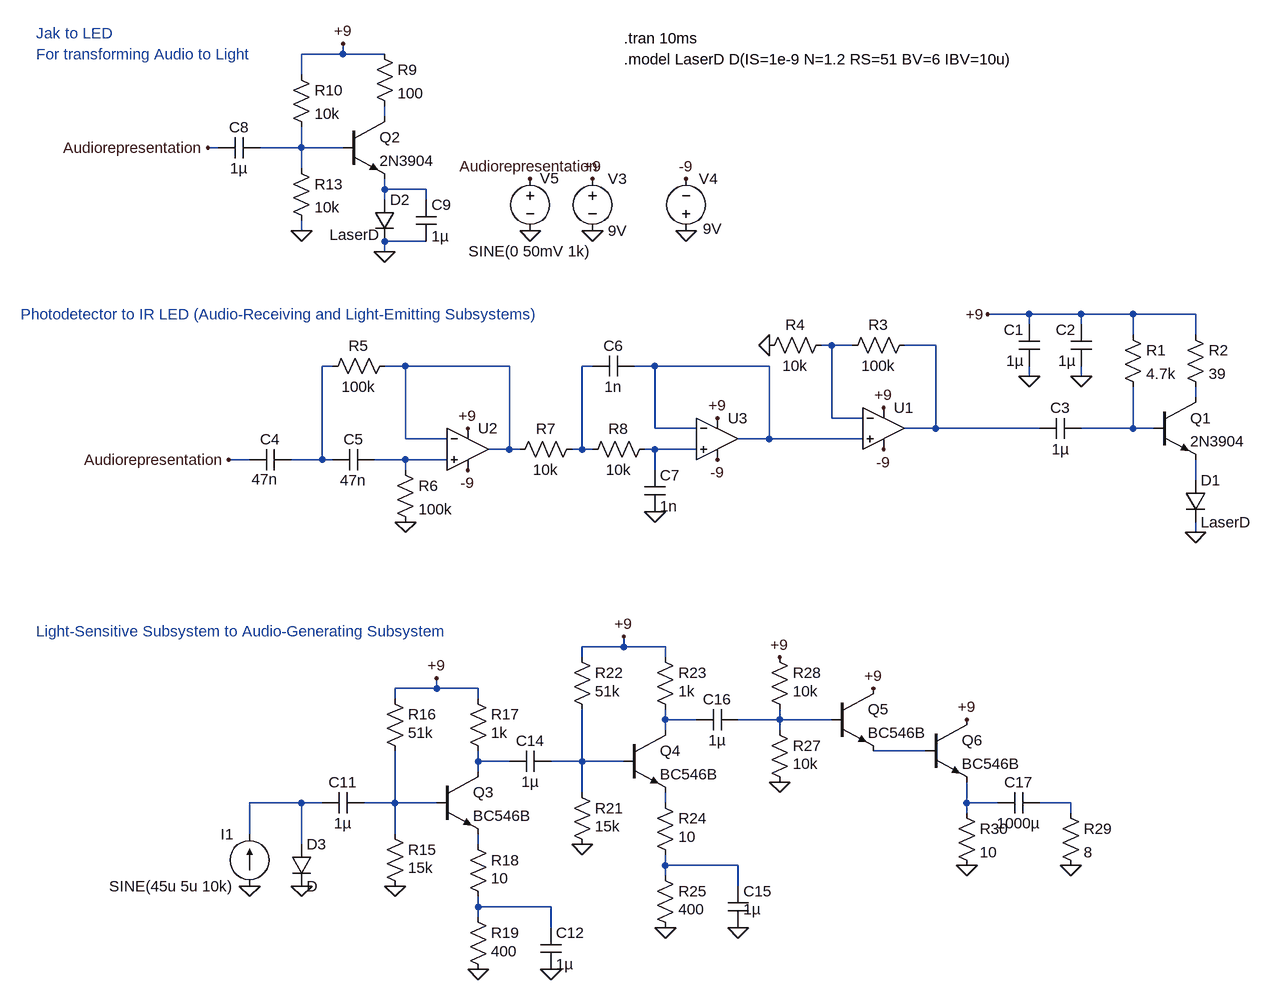
[diagram p0: schematic proje_deneme_mus.asc]
proje_deneme_mus.asc, the LTspice schematic file:
Version 4
SHEET 1 2692 1444
WIRE -800 -208 -800 -224
WIRE -800 -208 -864 -208
WIRE -736 -208 -800 -208
WIRE -864 -176 -864 -208
WIRE -736 -112 -736 -128
WIRE -992 -64 -1008 -64
WIRE -864 -64 -864 -96
WIRE -864 -64 -928 -64
WIRE -800 -64 -864 -64
WIRE -864 -32 -864 -64
WIRE -736 0 -736 -16
WIRE -672 0 -736 0
WIRE -736 16 -736 0
WIRE -672 16 -672 0
WIRE -864 64 -864 48
WIRE -672 80 -736 80
WIRE -736 96 -736 80
WIRE 256 192 192 192
WIRE 336 192 256 192
WIRE 416 192 336 192
WIRE 512 192 416 192
WIRE 256 208 256 192
WIRE 336 208 336 192
WIRE 416 224 416 192
WIRE 512 224 512 192
WIRE -48 240 -64 240
WIRE -16 240 -48 240
WIRE 112 240 64 240
WIRE -816 272 -832 272
WIRE -704 272 -736 272
WIRE -544 272 -704 272
WIRE -416 272 -432 272
WIRE -320 272 -352 272
WIRE -144 272 -320 272
WIRE 256 288 256 272
WIRE 336 288 336 272
WIRE 512 320 512 304
WIRE -48 352 -48 240
WIRE 0 352 -48 352
WIRE -320 368 -320 272
WIRE -256 368 -320 368
WIRE 112 368 112 240
WIRE 112 368 64 368
WIRE 272 368 112 368
WIRE 416 368 416 304
WIRE 416 368 336 368
WIRE 448 368 416 368
WIRE -704 384 -704 272
WIRE -640 384 -704 384
WIRE -144 384 -144 272
WIRE -144 384 -192 384
WIRE 0 384 -144 384
WIRE -544 400 -544 272
WIRE -544 400 -576 400
WIRE -528 400 -544 400
WIRE -432 400 -432 272
WIRE -432 400 -448 400
WIRE -416 400 -432 400
WIRE -320 400 -336 400
WIRE -256 400 -320 400
WIRE -944 416 -976 416
WIRE -832 416 -832 272
WIRE -832 416 -880 416
WIRE -816 416 -832 416
WIRE -704 416 -752 416
WIRE -640 416 -704 416
WIRE -704 432 -704 416
WIRE -320 432 -320 400
WIRE 512 448 512 416
WIRE 512 528 512 512
WIRE -368 704 -368 688
WIRE -368 704 -432 704
WIRE -304 704 -368 704
WIRE -432 720 -432 704
WIRE -304 720 -304 704
WIRE -656 768 -656 752
WIRE -656 768 -720 768
WIRE -592 768 -656 768
WIRE -720 784 -720 768
WIRE -592 784 -592 768
WIRE -304 816 -304 800
WIRE -256 816 -304 816
WIRE -128 816 -128 800
WIRE -128 816 -192 816
WIRE -48 816 -128 816
WIRE -304 832 -304 816
WIRE -128 832 -128 816
WIRE 96 864 16 864
WIRE -592 880 -592 864
WIRE -544 880 -592 880
WIRE -432 880 -432 800
WIRE -432 880 -480 880
WIRE -368 880 -432 880
WIRE -592 896 -592 880
WIRE -432 928 -432 880
WIRE -864 944 -944 944
WIRE -832 944 -864 944
WIRE -720 944 -720 864
WIRE -720 944 -768 944
WIRE -656 944 -720 944
WIRE -304 944 -304 928
WIRE 160 944 160 912
WIRE 208 944 160 944
WIRE 320 944 272 944
WIRE 160 960 160 944
WIRE 320 960 320 944
WIRE -944 992 -944 944
WIRE -720 992 -720 944
WIRE -864 1008 -864 944
WIRE -592 1008 -592 992
WIRE -304 1040 -304 1024
WIRE -192 1040 -304 1040
WIRE -304 1056 -304 1040
WIRE -192 1072 -192 1040
WIRE -592 1104 -592 1088
WIRE -480 1104 -592 1104
WIRE -592 1120 -592 1104
WIRE -480 1136 -480 1104
FLAG 336 288 0
FLAG 256 288 0
FLAG 512 528 0
FLAG 32 336 +9
FLAG 32 400 -9
FLAG -144 240 0
FLAG -272 64 0
FLAG -416 64 0
FLAG -416 -16 +9
FLAG -272 -16 -9
FLAG -704 512 0
FLAG -608 368 +9
FLAG -224 352 +9
FLAG -224 416 -9
FLAG -608 432 -9
FLAG -320 496 0
FLAG -512 64 0
FLAG 192 192 +9
FLAG -800 -224 +9
FLAG -736 96 0
FLAG -864 64 0
FLAG -720 1072 0
FLAG -656 752 +9
FLAG -432 1008 0
FLAG -368 688 +9
FLAG -304 1136 0
FLAG -192 1136 0
FLAG -128 912 0
FLAG -128 720 +9
FLAG 16 768 +9
FLAG 160 816 +9
FLAG 160 1040 0
FLAG 320 1040 0
FLAG -592 1200 0
FLAG -480 1200 0
FLAG -944 1072 0
FLAG -864 1072 0
FLAG -976 416 Audiorepresentation
FLAG -512 -16 Audiorepresentation
FLAG -1008 -64 Audiorepresentation
SYMBOL cap 272 272 R180
WINDOW 0 24 56 Left 2
WINDOW 3 24 8 Left 2
SYMATTR InstName C1
SYMATTR Value 1µ
SYMBOL cap 352 272 R180
WINDOW 0 24 56 Left 2
WINDOW 3 24 8 Left 2
SYMATTR InstName C2
SYMATTR Value 1µ
SYMBOL cap 336 352 R90
WINDOW 0 0 32 VBottom 2
WINDOW 3 32 32 VTop 2
SYMATTR InstName C3
SYMATTR Value 1µ
SYMBOL res 400 208 R0
SYMATTR InstName R1
SYMATTR Value 4.7k
SYMBOL res 496 208 R0
SYMATTR InstName R2
SYMATTR Value 39
SYMBOL npn 448 320 R0
SYMATTR InstName Q1
SYMATTR Value 2N3904
SYMBOL diode 496 448 R0
SYMATTR InstName D1
SYMATTR Value LaserD
SYMBOL OpAmps\\UniversalOpAmp2 32 368 R0
SYMATTR InstName U1
SYMBOL res 80 224 R90
WINDOW 0 0 56 VBottom 2
WINDOW 3 32 56 VTop 2
SYMATTR InstName R3
SYMATTR Value 100k
SYMBOL res -160 256 R270
WINDOW 0 32 56 VTop 2
WINDOW 3 0 56 VBottom 2
SYMATTR InstName R4
SYMATTR Value 10k
SYMBOL voltage -416 -32 R0
WINDOW 123 0 0 Left 0
WINDOW 39 0 0 Left 0
SYMATTR InstName V3
SYMATTR Value 9V
SYMBOL voltage -272 80 R180
WINDOW 0 -49 96 Left 2
WINDOW 3 -55 19 Left 2
WINDOW 123 0 0 Left 0
WINDOW 39 0 0 Left 0
SYMATTR InstName V4
SYMATTR Value 9V
SYMBOL cap -880 432 M270
WINDOW 0 32 32 VTop 2
WINDOW 3 -14 61 VLeft 2
SYMATTR InstName C4
SYMATTR Value 47n
SYMBOL cap -752 400 R90
WINDOW 0 0 32 VBottom 2
WINDOW 3 32 32 VTop 2
SYMATTR InstName C5
SYMATTR Value 47n
SYMBOL res -720 256 R90
WINDOW 0 0 56 VBottom 2
WINDOW 3 32 56 VTop 2
SYMATTR InstName R5
SYMATTR Value 100k
SYMBOL res -720 416 R0
SYMATTR InstName R6
SYMATTR Value 100k
SYMBOL OpAmps\\UniversalOpAmp2 -608 400 R0
SYMATTR InstName U2
SYMBOL OpAmps\\UniversalOpAmp2 -224 384 R0
SYMATTR InstName U3
SYMBOL res -432 384 R90
WINDOW 0 0 56 VBottom 2
WINDOW 3 32 56 VTop 2
SYMATTR InstName R7
SYMATTR Value 10k
SYMBOL cap -352 256 R90
WINDOW 0 0 32 VBottom 2
WINDOW 3 32 32 VTop 2
SYMATTR InstName C6
SYMATTR Value 1n
SYMBOL cap -336 432 R0
SYMATTR InstName C7
SYMATTR Value 1n
SYMBOL res -320 384 R90
WINDOW 0 0 56 VBottom 2
WINDOW 3 32 56 VTop 2
SYMATTR InstName R8
SYMATTR Value 10k
SYMBOL voltage -512 -32 R0
WINDOW 0 30 31 Bottom 2
WINDOW 3 -1 112 Top 2
WINDOW 123 0 0 Left 0
WINDOW 39 0 0 Left 0
SYMATTR InstName V5
SYMATTR Value SINE(0 50mV 1k)
SYMBOL cap -928 -80 R90
WINDOW 0 0 32 VBottom 2
WINDOW 3 32 32 VTop 2
SYMATTR InstName C8
SYMATTR Value 1µ
SYMBOL npn -800 -112 R0
SYMATTR InstName Q2
SYMATTR Value 2N3904
SYMBOL res -752 -224 R0
SYMATTR InstName R9
SYMATTR Value 100
SYMBOL res -880 -192 R0
SYMATTR InstName R10
SYMATTR Value 10k
SYMBOL res -880 -48 R0
SYMATTR InstName R13
SYMATTR Value 10k
SYMBOL diode -752 16 R0
WINDOW 3 -69 54 Left 2
SYMATTR InstName D2
SYMATTR Value LaserD
SYMBOL cap -688 16 R0
SYMATTR InstName C9
SYMATTR Value 1µ
SYMBOL cap -768 928 R90
WINDOW 0 0 32 VBottom 2
WINDOW 3 32 32 VTop 2
SYMATTR InstName C11
SYMATTR Value 1µ
SYMBOL res -736 976 R0
WINDOW 3 36 68 Left 2
SYMATTR InstName R15
SYMATTR Value 15k
SYMBOL res -736 768 R0
WINDOW 3 36 68 Left 2
SYMATTR InstName R16
SYMATTR Value 51k
SYMBOL res -608 768 R0
WINDOW 3 36 68 Left 2
SYMATTR InstName R17
SYMATTR Value 1k
SYMBOL npn -656 896 R0
SYMATTR InstName Q3
SYMATTR Value BC546B
SYMBOL cap -480 864 R90
WINDOW 0 0 32 VBottom 2
WINDOW 3 32 32 VTop 2
SYMATTR InstName C14
SYMATTR Value 1µ
SYMBOL res -448 912 R0
WINDOW 3 36 68 Left 2
SYMATTR InstName R21
SYMATTR Value 15k
SYMBOL res -448 704 R0
WINDOW 3 36 68 Left 2
SYMATTR InstName R22
SYMATTR Value 51k
SYMBOL res -320 704 R0
WINDOW 3 36 68 Left 2
SYMATTR InstName R23
SYMATTR Value 1k
SYMBOL npn -368 832 R0
SYMATTR InstName Q4
SYMATTR Value BC546B
SYMBOL res -320 928 R0
WINDOW 3 36 68 Left 2
SYMATTR InstName R24
SYMATTR Value 10
SYMBOL res -320 1040 R0
WINDOW 3 36 68 Left 2
SYMATTR InstName R25
SYMATTR Value 400
SYMBOL cap -208 1072 R0
WINDOW 3 24 36 Left 2
SYMATTR InstName C15
SYMATTR Value 1µ
SYMBOL cap -192 800 R90
WINDOW 0 0 32 VBottom 2
WINDOW 3 32 32 VTop 2
SYMATTR InstName C16
SYMATTR Value 1µ
SYMBOL res -144 816 R0
WINDOW 3 36 68 Left 2
SYMATTR InstName R27
SYMATTR Value 10k
SYMBOL res -144 704 R0
WINDOW 3 36 68 Left 2
SYMATTR InstName R28
SYMATTR Value 10k
SYMBOL npn -48 768 R0
SYMATTR InstName Q5
SYMATTR Value BC546B
SYMBOL npn 96 816 R0
SYMATTR InstName Q6
SYMATTR Value BC546B
SYMBOL cap 272 928 R90
WINDOW 0 0 32 VBottom 2
WINDOW 3 32 32 VTop 2
SYMATTR InstName C17
SYMATTR Value 1000µ
SYMBOL res 304 944 R0
SYMATTR InstName R29
SYMATTR Value 8
SYMBOL res 144 944 R0
SYMATTR InstName R30
SYMATTR Value 10
SYMBOL res -608 992 R0
WINDOW 3 36 68 Left 2
SYMATTR InstName R18
SYMATTR Value 10
SYMBOL res -608 1104 R0
WINDOW 3 36 68 Left 2
SYMATTR InstName R19
SYMATTR Value 400
SYMBOL cap -496 1136 R0
SYMATTR InstName C12
SYMATTR Value 1µ
SYMBOL current -944 1072 R180
WINDOW 0 24 80 Left 2
WINDOW 3 24 0 Left 2
WINDOW 123 0 0 Left 0
WINDOW 39 0 0 Left 0
SYMATTR InstName I1
SYMATTR Value SINE(45u 5u 10k)
SYMBOL diode -880 1008 R0
SYMATTR InstName D3
TEXT -368 -232 Left 2 !.tran 10ms
TEXT -368 -200 Left 2 !.model LaserD D(IS=1e-9 N=1.2 RS=51 BV=6 IBV=10u)
TEXT -1272 -240 Left 2 ;Jak to LED
TEXT -1296 192 Left 2 ;Photodetector to IR LED (Audio-Receiving and Light-Emitting Subsystems)
TEXT -1272 -208 Left 2 ;For transforming Audio to Light
TEXT -1272 680 Left 2 ;Light-Sensitive Subsystem to Audio-Generating Subsystem

The netlist it stands for:
* proje_deneme_mus.asc
C1 0 +9 1µ
C2 0 +9 1µ
C3 N011 N005 1µ
R1 +9 N011 4.7k
R2 +9 N010 39
Q1 N010 N011 N014 0 2N3904
D1 N014 0 LaserD
XU1 N009 N004 +9 -9 N005 level2 Avol=1Meg GBW=10Meg Slew=10Meg Ilimit=25m Rail=0 Vos=0 En=0 Enk=0 In=0 Ink=0 Rin=500Meg  ; pins In+ In- V+ V- OUT
R3 N005 N004 100k
R4 0 N004 10k
V3 +9 0 9V
V4 0 -9 9V
C4 N006 Audiorepresentation 47n
C5 N013 N006 47n
R5 N007 N006 100k
R6 N013 0 100k
XU2 N013 N007 +9 -9 N007 level2 Avol=1Meg GBW=10Meg Slew=10Meg Ilimit=25m Rail=0 Vos=0 En=0 Enk=0 In=0 Ink=0 Rin=500Meg  ; pins In+ In- V+ V- OUT
XU3 N012 N009 +9 -9 N009 level2 Avol=1Meg GBW=10Meg Slew=10Meg Ilimit=25m Rail=0 Vos=0 En=0 Enk=0 In=0 Ink=0 Rin=500Meg  ; pins In+ In- V+ V- OUT
R7 N008 N007 10k
C6 N009 N008 1n
C7 N012 0 1n
R8 N012 N008 10k
V5 Audiorepresentation 0 SINE(0 50mV 1k)
C8 N002 Audiorepresentation 1µ
Q2 N001 N002 N003 0 2N3904
R9 +9 N001 100
R10 +9 N002 10k
R13 N002 0 10k
D2 N003 0 LaserD
C9 N003 0 1µ
C11 N021 N020 1µ
R15 N021 0 15k
R16 +9 N021 51k
R17 +9 N018 1k
Q3 N018 N021 N025 0 BC546B
C14 N019 N018 1µ
R21 N019 0 15k
R22 +9 N019 51k
R23 +9 N015 1k
Q4 N015 N019 N022 0 BC546B
R24 N022 N026 10
R25 N026 0 400
C15 N026 0 1µ
C16 N016 N015 1µ
R27 N016 0 10k
R28 +9 N016 10k
Q5 +9 N016 N017 0 BC546B
Q6 +9 N017 N023 0 BC546B
C17 N024 N023 1000µ
R29 N024 0 8
R30 N023 0 10
R18 N025 N027 10
R19 N027 0 400
C12 N027 0 1µ
I1 0 N020 SINE(45u 5u 10k)
D3 N020 0 D
.model D D
.lib standard.dio
.model NPN NPN
.model PNP PNP
.lib standard.bjt
.tran 10ms
.model LaserD D(IS=1e-9 N=1.2 RS=51 BV=6 IBV=10u)
* Jak to LED
* Photodetector to IR LED (Audio-Receiving and Light-Emitting Subsystems)
* For transforming Audio to Light
* Light-Sensitive Subsystem to Audio-Generating Subsystem
.lib UniversalOpAmp2.lib
.backanno
.end